# EAGLE design SWR5.1 (EAGLE 9.3.2)
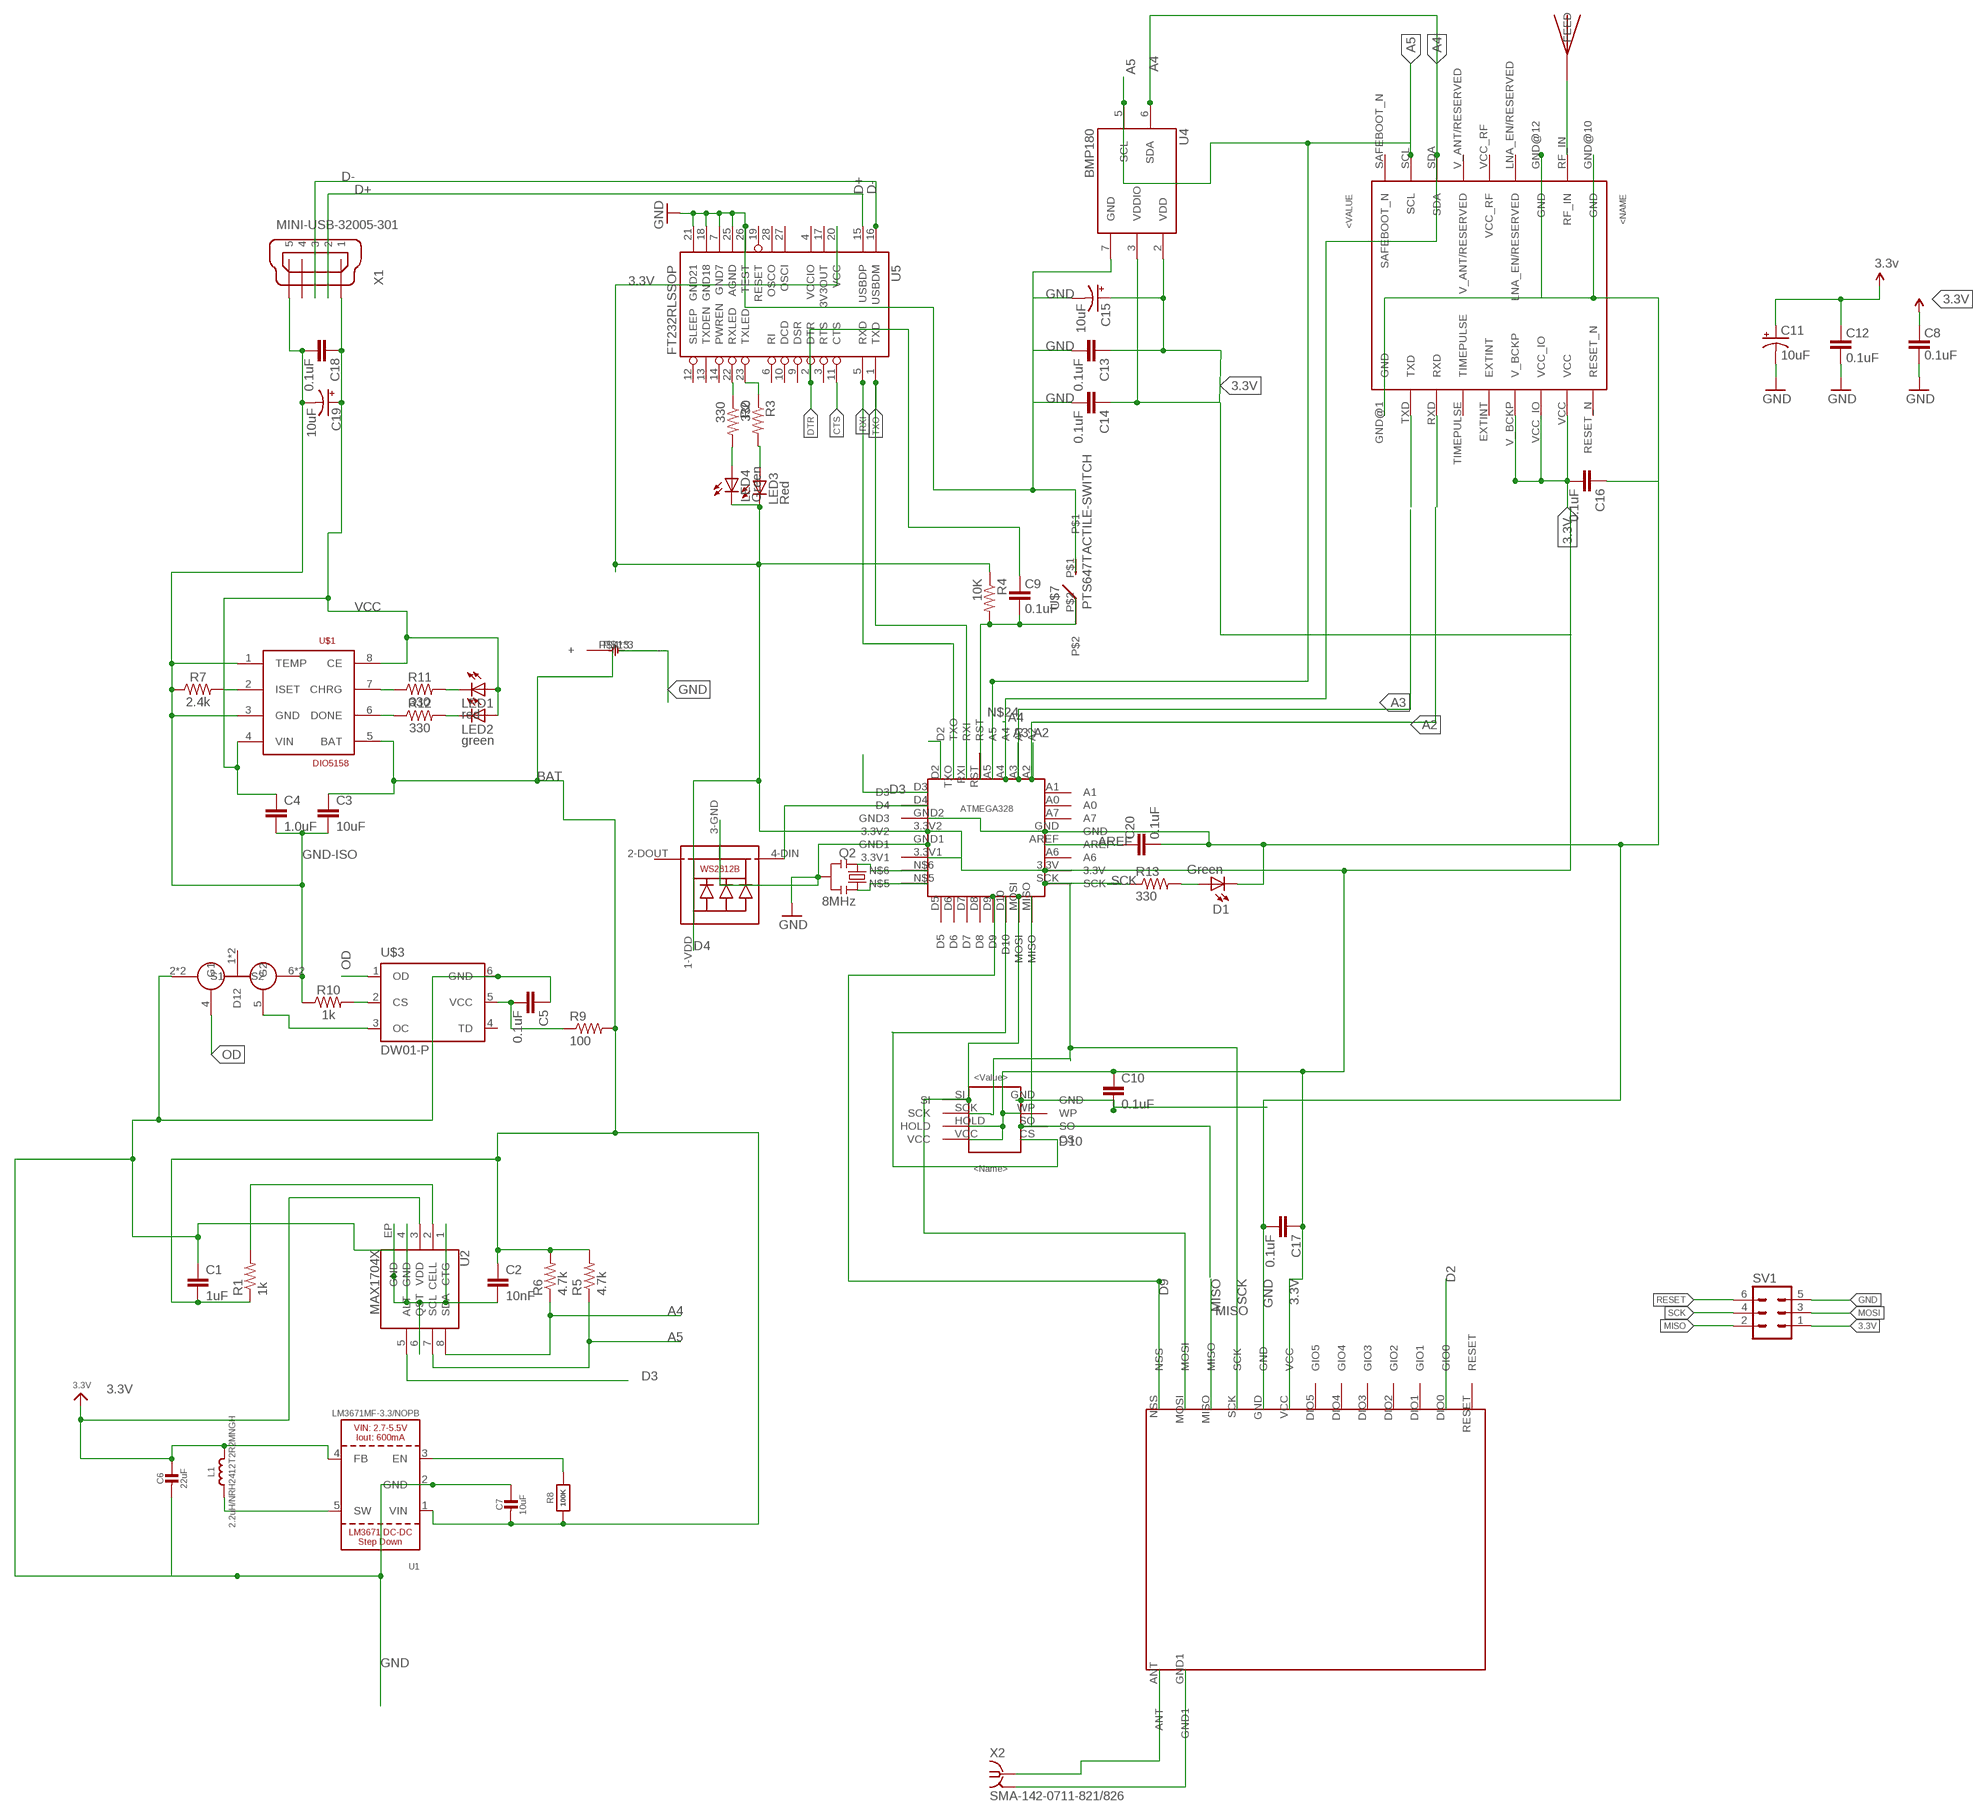
[diagram p0: schematic, sheet 1]

## Parts
C1  1uF  CAP0402-CAP  [0402-CAP]
C2  10nF  CAP0402-CAP  [0402-CAP]
C3  10uF  10UF-1206-6.3V-20%  [1206]
C4  1.0uF  1.0UF-0603-16V-10%  [0603]
C5  0.1uF  0.1UF-0603-25V-5%  [0603]
C6  22uF  CAP_CERAMIC0805-NOOUTLINE  [0805-NO]
C7  10uF  CAP_CERAMIC0805-NOOUTLINE  [0805-NO]
C8  0.1uF  CAP0603-CAP  [0603-CAP]
C9  0.1uF  CAP0603-CAP  [0603-CAP]
C10  0.1uF  CAP0603-CAP  [0603-CAP]
C11  10uF  CAP_POL3528  [EIA3528]
C12  0.1uF  CAP0603-CAP  [0603-CAP]
C13  0.1uF  CAP0603-CAP  [0603-CAP]
C14  0.1uF  CAP0603-CAP  [0603-CAP]
C15  10uF  10UF-16V-10%(TANT)  [EIA3216]
C16  0.1uF  CAP0603-CAP  [0603-CAP]
C17  0.1uF  CAP0603-CAP  [0603-CAP]
C18  0.1uF  CAP0603-CAP  [0603-CAP]
C19  10uF  CAP_POL1206  [EIA3216]
C20  0.1uF  CAP0603-CAP  [0603-CAP]
D1  Green  LED  [0603-LED-ALT1]
GND-ISO  18650BATT  [18650BATT]
L1  2.2uH/NRH2412T2R2MNGH  INDUCTORNRH2412T  [INDUCTOR_TAIYOYUDEN_NRH2412T]
LED1  red  LEDCHIP-LED0805  [CHIP-LED0805]
LED2  green  LEDCHIP-LED0805  [CHIP-LED0805]
LED3  Red  LED0603  [LED-0603]
LED4  Green  LED0603  [LED-0603]
LED5  WS2812B5050  [WS2812B]
LORATX  SX1272BETTER  [SX1272BETTER]
Q2  8MHz  RESONATOR1:1  [RESONATOR-SMD-1:1]
R1  1k  RESISTOR0402-RES  [0402-RES]
R2  330  RESISTOR0603-RES  [0603-RES]
R3  330  RESISTOR0603-RES  [0603-RES]
R4  10K  RESISTOR0603-RES  [0603-RES]
R5  4.7k  RESISTOR0402-RES  [0402-RES]
R6  4.7k  RESISTOR0402-RES  [0402-RES]
R7  2.4k  2.49KOHM-0603-1/10W-1%  [0603]
R8  100K  RESISTOR0805_NOOUTLINE  [0805-NO]
R9  100  RESISTOR0603-RES  [0603-RES]
R10  1k  1KOHM-0603-1/10W-1%  [0603]
R11  330  330OHM-0603-1/10W-1%  [0603]
R12  330  330OHM-0603-1/10W-1%  [0603]
R13  330  RESISTOR0603-RES  [0603-RES]
SV1  MA03-2  [MA03-2]
U1  LM3671MF-3.3/NOPB  VREG_LM3671  [SOT23-5]
U2  MAX1704X  [TDFN-8]
U4  BMP180  [BMP180]
U5  FT232RLSSOP  [SSOP28DB]
U$1  DIO5158  [SOIC-8]
U$2  AT25STORAGE  [AT25STORAGE]
U$3  DW01-P  [SOT23-6L]
U$4  FS8205A  [TSSOP8]
U$5  ATMEGA328  [ATMEGA328]
U$7  PTS647TACTILE-SWITCH  [PTS647TACTILE-SWITCH]
U$8  AVA_JTI_ANTENNA-1575AT43A40  [AVA_JTI_ANTENNA-1575AT43A40]
UBLX_MAX-M8Q  UBLXM8Q  [UBLOXM8Q]
X1  MINI-USB-32005-301  [32005-301]
X2  SMA-142-0711-821/826  [J502-ND-142-0711-821/826]

## Nets
3.3V: C6.1 C8.2 C10.1 C11.A(+) C12.2 C13.1 C14.1 C15.A(+) C16.2 C17.1 L1.2 LED3.C LED4.C LED5.1-VDD(VDD) LORATX.VCC R4.1 SV1.1 U1.4(FB) U2.3(VDD) U4.2(VDD) U4.3(VDDIO) U5.20(VCC) U$2.HOLD U$2.VCC U$2.WP U$5.3.3V U$5.3.3V1 U$5.3.3V2 UBLX_MAX-M8Q.V_BCKP UBLX_MAX-M8Q.VCC UBLX_MAX-M8Q.VCC_IO ; supply symbol labelled 3.3v, VCC
A2: U$5.A2 UBLX_MAX-M8Q.RXD
A3: U$5.A3 UBLX_MAX-M8Q.TXD
A4: R6.1 U2.8(SDA) U4.6(SDA) U$5.A4 UBLX_MAX-M8Q.SDA
A5: R5.1 U2.7(SCL) U4.5(SCL) U$5.A5 UBLX_MAX-M8Q.SCL
AREF: C20.2 U$5.AREF
BAT: C1.2 C2.1 C3.1 C7.2 GND-ISO.P$4(+) GND-ISO.P$5(+) GND-ISO.P$6(+) R1.1 R5.2 R6.2 R8.1 R9.2 U1.1(VIN) U$1.5(BAT)
CELL: R1.2 U2.2(CELL)
CHRG: R11.1 U$1.7(CHRG)
CS: R10.2 U$3.2(CS)
CTS: U5.11(CTS)
D2: LORATX.DIO0(GIO0) U$5.D2
D3: U2.5(ALT) U$5.D3
D4: LED5.4-DIN(DI) U$5.D4
D9: LORATX.NSS U$5.D9
D10: U$2.CS U$5.D10
D+: U5.15(USBDP) X1.2
D-: U5.16(USBDM) X1.3
DONE: R12.1 U$1.6(DONE)
DTR: C9.2 U5.2(DTR)
EN: R8.2 U1.3(EN)
GND: C1.1 C2.2 C5.1 C6.2 C7.1 C8.1 C10.2 C11.C(-) C12.1 C13.2 C14.2 C15.C(-) C16.1 C17.2 C20.1 D1.C GND-ISO.P$1(-) GND-ISO.P$2(-) GND-ISO.P$3(-) LED5.3-GND(GND) LORATX.GND LORATX.GND1 Q2.2 SV1.5 U1.2(GND) U2.1(CTG) U2.4(GND) U2.6(QST) U2.EP(GND) U4.7(GND) U5.7(GND7) U5.18(GND18) U5.21(GND21) U5.25(AGND) U5.26(TEST) U$2.GND U$3.6(GND) U$4.2(S1) U$4.3(S1) U$5.GND U$5.GND1 U$5.GND2(GND3) U$7.P$1 UBLX_MAX-M8Q.GND@1(GND) UBLX_MAX-M8Q.GND@10(GND) UBLX_MAX-M8Q.GND@12(GND) X2.G@1 X2.G@2 X2.G@3 X2.G@4
GND-ISO: C3.2 C4.2 C18.2 C19.C(-) R7.1 R10.1 U$1.1(TEMP) U$1.3(GND) U$4.6(S2) U$4.7(S2) X1.5
ISET: R7.2 U$1.2(ISET)
LED2: LED2.C R12.2
MISO: LORATX.MISO SV1.2 U$2.SO U$5.MISO
MOSI: LORATX.MOSI SV1.3 U$2.SI U$5.MOSI
N$1: C5.2 R9.1 U$3.5(VCC)
N$2: R3.1 U5.23(TXLED)
N$7: R2.1 U5.22(RXLED)
N$12: Q2.3 U$5.N$5
N$14: LED1.C R11.2
N$17: Q2.1 U$5.N$6
N$25: LED4.A R2.2
N$26: LORATX.ANT X2.1
N$29: LED3.A R3.2
N$31: D1.A R13.2
OC: U$3.3(OC) U$4.5(G2)
OD: U$3.1(OD) U$4.4(G1)
RESET: C9.1 R4.2 SV1.6 U$5.RST U$7.P$2
RF_IN: U$8.FEED UBLX_MAX-M8Q.RF_IN
RXI: U5.5(RXD) U$5.TXO
SCK: LORATX.SCK R13.1 SV1.4 U$2.SCK U$5.SCK
SW: L1.1 U1.5(SW)
TXO: U5.1(TXD) U$5.RXI
VCC: C4.1 C18.1 C19.A(+) LED1.A LED2.A U$1.4(VIN) U$1.8(CE) X1.1
Unconnected: LED5.2-DOUT(DO) LORATX.DIO1(GIO1) LORATX.DIO2(GIO2) LORATX.DIO3(GIO3) LORATX.DIO4(GIO4) LORATX.DIO5(GIO5) LORATX.RESET U5.3(RTS) U5.6(RI) U5.9(DSR) U5.10(DCD) U5.12(SLEEP) U5.13(TXDEN) U5.14(PWREN) U5.17(3V3OUT) U5.19(RESET) U5.27(OSCI) U5.28(OSCO) U$3.4(TD) U$4.1(D12) U$4.8(D12) U$5.A0 U$5.A1 U$5.A6 U$5.A7 U$5.D5 U$5.D6 U$5.D7 U$5.D8 UBLX_MAX-M8Q.EXTINT UBLX_MAX-M8Q.LNA_EN/RESERVED UBLX_MAX-M8Q.RESET_N UBLX_MAX-M8Q.SAFEBOOT_N UBLX_MAX-M8Q.TIMEPULSE UBLX_MAX-M8Q.V_ANT/RESERVED UBLX_MAX-M8Q.VCC_RF X1.4

## Power pins joined to a net without a drawn wire
VCCIO: U5.4(VCCIO)

## Library data of the parts
C1 C2 C8 C9 C12 C18 C20 = SparkFun:CAP: Capacitor Standard 0603 ceramic capacitor, and 0.1" leaded capacitor.
C3 = SparkFun-Capacitors:10UF: 10.0µF ceramic capacitors A capacitor is a passive two-terminal electrical component used to store electrical energy temporarily in an electric field.; PROD_ID: CAP-10057
C4 = SparkFun-Capacitors:1.0UF: 1µF ceramic capacitors A capacitor is a passive two-terminal electrical component used to store electrical energy temporarily in an electric field.; PROD_ID: CAP-00868
C5 = SparkFun-Capacitors:0.1UF: 0.1µF ceramic capacitors A capacitor is a passive two-terminal electrical component used to store electrical energy temporarily in an electric field.; PROD_ID: CAP-08604
C6 C7 = microbuilder:CAP_CERAMIC: Ceramic Capacitors For new designs, use the packages preceded by an '_' character since they are more reliable: The following footprints should be used on most boards: _0402 - Standard footprint for regular board layouts _0603 - Standard footprint for regular board layouts _0805 - Standard footprint for regular board layouts _1206 - Standard footprint for regular board layouts For extremely tight-pitch boards where space is at a premium, the following 'micro-pitch' footprints can be used (smaller pads, no silkscreen outline, etc.): _0402MP - Micro-pitch footprint for very dense/compact boards _0603MP - Micro-pitch footprint for very dense/compact boards _0805MP - Micro-pitch footprint for very dense/compact boards _1206MP - Micro-pitch footprint for very dense/compact boards
C10 C13 C14 C16 C17 = SparkFun-Capacitors:CAP: Capacitor Standard 0603 ceramic capacitor, and 0.1" leaded capacitor.
C11 C19 = SparkFun:CAP_POL: Capacitor Polarized These are standard SMD and PTH capacitors. Normally 10uF, 47uF, and 100uF in electrolytic and tantalum varieties. Always verify the external diameter of the through hole cap, it varies with capacity, voltage, and manufacturer. The EIA devices should be standard.
C15 = SparkFun-Capacitors:10UF-16V-10%(TANT): CAP-00811 1206/EIA-3216 Tantalum capacitor; PROD_ID: CAP-00811
D1 = Testing:LED: LEDs Standard schematic elements and footprints for 5mm, 3mm, 1206, and 0603 sized LEDs. 5mm - Spark Fun Electronics SKU : COM-00529 (and others)
GND-ISO = 18650BATT:18650BATT
L1 = microbuilder:INDUCTOR: Inductors 0603: 10nH Ceramic Inductor - microwire antenna/RF (Digikey: 712-1434-2-ND) 0805: 560nH Ceramic Inductor - RF (Digikey: 553-1047-1-ND) 270nH Ceramic Inductor - Q = 40@250MHz, +-5%, 1 Ohm DC Resistance (Digikey: 535-10506-2-ND) 1007 (2518 Metric) SMT: 10µH 10% 250mOhm 820mA 1007 Inductor (Digikey: 587-2189-1-ND) 22µH 10% 500mOhm 580mA 1007 Inductor (Digikey: 587-2190-1-ND) 47µH 10% 950mOhm 420mA 1007 Inductor (Digikey: 587-2191-1-ND) 47µH 5% 100mOhm 1A 1008 Inductor (Digikey: 732-1816-1-ND) 5.0x5.0mm (Taiyo Yuden NR5040 Series) 6.8µH 20% 2.3A 64mOhm Inductor (Digikey: 587-2374-2-ND) 5.0x5.0mm (TDK VLC5045 Series) 4.7µH 20% 3.3A 34mOhm Inductor (Digikey: 445-6526-1-ND) 6.8µH 20% 2.7A 46mOhm Inductor (Digikey: 445-6527-1-ND) 6.0x6.0mm (TDK VLC6045 Series) 4.7µH 20% 3.8A 27mOhm Inductor (Digikey: 445-6538-2-ND) 6.8µH 20% 3A 41mOhm Inductor (Digikey: 445-6540-1-ND) 6.2µH 30% 2.2A 45mOhm Inductor (Digikey: SRR5028-6R2YCT-ND) - Not TDK VLC6045 but footprint should match 6.0x6.0mm (TDK SLF6045 Series) 6.8uH 30% 2A 33mOhm Inductor (Digikey: 445-4572-1-ND, Mouser: 810-SLF645T6R8N2R0PF) 6.0x6.0mm (Sumida CDRH5D28 Series) 6.2uH 30% 1.8A 45mOhm Inductor (Digikey: 308-1542-1-ND) Taiyo Yuden NR3015T2R2M - 2.2uH 20% 1.5A (Digikey: 587-1648-2-ND, Mouser: 963-NR3015T2R2M) - Used with TI TPS62172 CoilCraft RFID Transponder Coil - MA5532-AE (For use with AS3935 Lightning Sensor) Taiyo Yuden NRH2412T2R2MNGH - 2.2uH 20% 1AA (Digikey: 587-3443-1-ND) - Used with TI LM3671 Vishay IHLP 1.0uH Molded Inductor - 24mOhm DCR, 5A, +/-20%, -55°C-125°C (Digikey: 541-1319-1-ND)
LED1 LED2 = adafruit:LED: LED OSRAM: - CHIPLED LG R971, LG N971, LY N971, LG Q971, LY Q971, LO R971, LY R971 LH N974, LH R974 LS Q976, LO Q976, LY Q976 LO Q996 - Hyper CHIPLED LW Q18S LB Q993, LB Q99A, LB R99A - SideLED LS A670, LO A670, LY A670, LG A670, LP A670 LB A673, LV A673, LT A673, LW A673 LH A674 LY A675 LS A676, LA A676, LO A676, LY A676, LW A676 LS A679, LY A679, LG A679 - Hyper Micro SIDELED® LS Y876, LA Y876, LO Y876, LY Y876 LT Y87S - SmartLED LW L88C, LW L88S LB L89C, LB L89S, LG L890 LS L89K, LO L89K, LY L89K LS L896, LA L896, LO L896, LY L896 - TOPLED LS T670, LO T670, LY T670, LG T670, LP T670 LSG T670, LSP T670, LSY T670, LOP T670, LYG T670 LG T671, LOG T671, LSG T671 LB T673, LV T673, LT T673, LW T673 LH T674 LS T676, LA T676, LO T676, LY T676, LB T676, LH T676, LSB T676, LW T676 LB T67C, LV T67C, LT T67C, LS T67K, LO T67K, LY T67K, LW E67C LS E67B, LA E67B, LO E67B, LY E67B, LB E67C, LV E67C, LT E67C LW T67C LS T679, LY T679, LG T679 LS T770, LO T770, LY T770, LG T770, LP T770 LB T773, LV T773, LT T773, LW T773 LH T774 LS E675, LA E675, LY E675, LS T675 LS T776, LA T776, LO T776, LY T776, LB T776 LHGB T686 LT T68C, LB T68C - Hyper Mini TOPLED® LB M676 - Mini TOPLED Santana® LG M470 LS M47K, LO M47K, LY M47K Source: http://www.osram.convergy.de/
LED3 LED4 = SparkFun:LED: LEDs Standard schematic elements and footprints for 5mm, 3mm, 1206, and 0603 sized LEDs. 5mm - Spark Fun Electronics SKU : COM-00529 (and others)
LED5 = microbuilder:WS2812B5050
LORATX = SX1272:SX1272BETTER
Q2 = Testing:RESONATOR: Resonator Small SMD resonator. This is the itty bitty 10/20MHz resonators with built in caps. CSTCE10M0G55 and CSTCE20M0V53. Footprint for SMD has been used in SFE production for years, and does work okay. 1:1 is an attempt to get larger fillets on the sides so it will be easier to inspect these solders in our AOI machine. The pads have been minimized to match the actual metal under the resonator. To see this relation, it includes an image import of the bottom side of the component. Imported to scale on layer 200.
R1-R6 R9 R13 = SparkFun:RESISTOR: Resistor Basic schematic elements and footprints for 0603, 1206, and PTH resistors.
R7 = SparkFun-Resistors:2.49KOHM: 2.49kΩ resistor A resistor is a passive two-terminal electrical component that implements electrical resistance as a circuit element. Resistors act to reduce current flow, and, at the same time, act to lower voltage levels within circuits. - Wikipedia; PROD_ID: RES-09568; VALUE: 2.49k
R8 = microbuilder:RESISTOR: Resistors For new designs, use the packages preceded by an '_' character since they are more reliable: The following footprints should be used on most boards: _0402 - Standard footprint for regular board layouts _0603 - Standard footprint for regular board layouts _0805 - Standard footprint for regular board layouts _1206 - Standard footprint for regular board layouts For extremely tight-pitch boards where space is at a premium, the following 'micro-pitch' footprints can be used (smaller pads, no silkscreen outline, etc.): _0402MP - Micro-pitch footprint for very dense/compact boards _0603MP - Micro-pitch footprint for very dense/compact boards _0805MP - Micro-pitch footprint for very dense/compact boards _1206MP - Micro-pitch footprint for very dense/compact boards
R10 = SparkFun-Resistors:1KOHM: 1kΩ resistor A resistor is a passive two-terminal electrical component that implements electrical resistance as a circuit element. Resistors act to reduce current flow, and, at the same time, act to lower voltage levels within circuits. - Wikipedia; PROD_ID: RES-07856
R11 R12 = SparkFun-Resistors:330OHM: 330Ω resistor A resistor is a passive two-terminal electrical component that implements electrical resistance as a circuit element. Resistors act to reduce current flow, and, at the same time, act to lower voltage levels within circuits. - Wikipedia; PROD_ID: RES-00818
SV1 = con-lstb:MA03-2: PIN HEADER; OC_FARNELL: unknown; OC_NEWARK: unknown
U1 = microbuilder:VREG_LM3671: LM3671 - 600mA DC-DC Step-Down Converter VIN: 2.7-5.5V Load Current: 600mA Switching Frequency: 2MHz Iq: 16uA
U2 = SparkFun:MAX1704X: MAX17043/MAX17044: Battery Fuel Guage (43 is 1cell, 44 is 2cell)
U4 = SparkFun-Sensors:BMP180: BOSCH BMP180 DIGITAL BAROMETRIC PRESSURE SENSOR Web page: http://www.bosch-sensortec.com/en/homepage/products_3/environmental_sensors_1/bmp180_1/bmp180 Datasheet: http://ae-bst.resource.bosch.com/media/products/dokumente/bmp180/BST-BMP180-DS000-09.pdf The BMP180 is the function compatible successor of the BMP085, a new generation of high precision digital pressure sensors for consumer applications. The ultra-low power, low voltage electronics of the BMP180 is optimized for use in mobile phones, PDAs, GPS navigation devices and outdoor equipment. With a low altitude noise of merely 0.25m at fast conversion time, the BMP180 offers superior performance. The I2C interface allows for easy system integration with a microcontroller. The BMP180 is based on piezo-resistive technology for EMC robustness, high accuracy and linearity as well as long term stability. Key features: - Temperature measurement included - I2C interface - Fully calibrated - Pb-free, halogen-free and RoHS compliant, - MSL 1 Basic specs: Pressure range: 300 to 1100hPa (+9000m to -500m relating to sea level) Supply voltage: 1.8 to 3.6V (VDD), 1.62V to 3.6V (VDDIO) Package: LGA package with metal lid Small footprint: 3.6mm x 3.8mm Super-flat: 0.93mm height Low power: 5μA at 1 sample / sec. in standard mode Low noise: 0.06hPa (0.5m) in ultra low power mode, 0.02hPa (0.17m) advanced resolution mode Typical applications: - Enhancement of GPS navigation (dead-reckoning, slope detection, etc.) - In- and out-door navigation - Leisure and sports - Weather forecast - Vertical velocity indication (rise/sink speed)
U5 = SparkFun:FT232RL: USB UART FT232RL 4th Generation USB UART (USB <-> Serial) Controller. Spark Fun Electronics SKU : COM-00650
U$1 = ERADIONICA:DIO5158
U$2 = Flash Memory 4Mb:AT25STORAGE
U$3 = lipo:DW01-P: One Cell Lithium-ion/Polymer Battery Protection IC The DW01-P battery protection IC is designed to protect lithium-ion/polymer battery from damage or degrading the lifetime due to overcharge, overdischarge, and/or overcurrent for one-cell lithium-ion/polymer battery powered systems, such as cellular phones. The ultra-small package and less required external components make it ideal to integrate the DW01-P into the limited space of battery pack. The accurate ±50mV overcharging detection voltage ensures safe and full utilization charging. The very low standby current drains little current from the cell while in storage.
U$4 = SparkFun:FS8205A
U$5 = ATMEGA328P:ATMEGA328
U$7 = PTS647-Switch:PTS647TACTILE-SWITCH
U$8 = picoAVA-R9:AVA_JTI_ANTENNA-1575AT43A40; OC_NEWARK: unknown
UBLX_MAX-M8Q = UBLOX_M8Q_GPS:UBLXM8Q
X1 = con-cypressindustries:MINI-USB-: MINI USB-B Conector Source: www.cypressindustries.com; OC_FARNELL: unknown; OC_NEWARK: unknown
X2 = con-coax:SMA-: SMA 50 Ohm End Launch Jack Receptacle - Round Contact Johnson Components Source: www.johnsoncomponents.com .. J502-ND.pdf; MF: JOHNSON COMPONENTS; MPN: 142-0711-821; OC_FARNELL: 1019328; OC_NEWARK: 16F3627

## Board
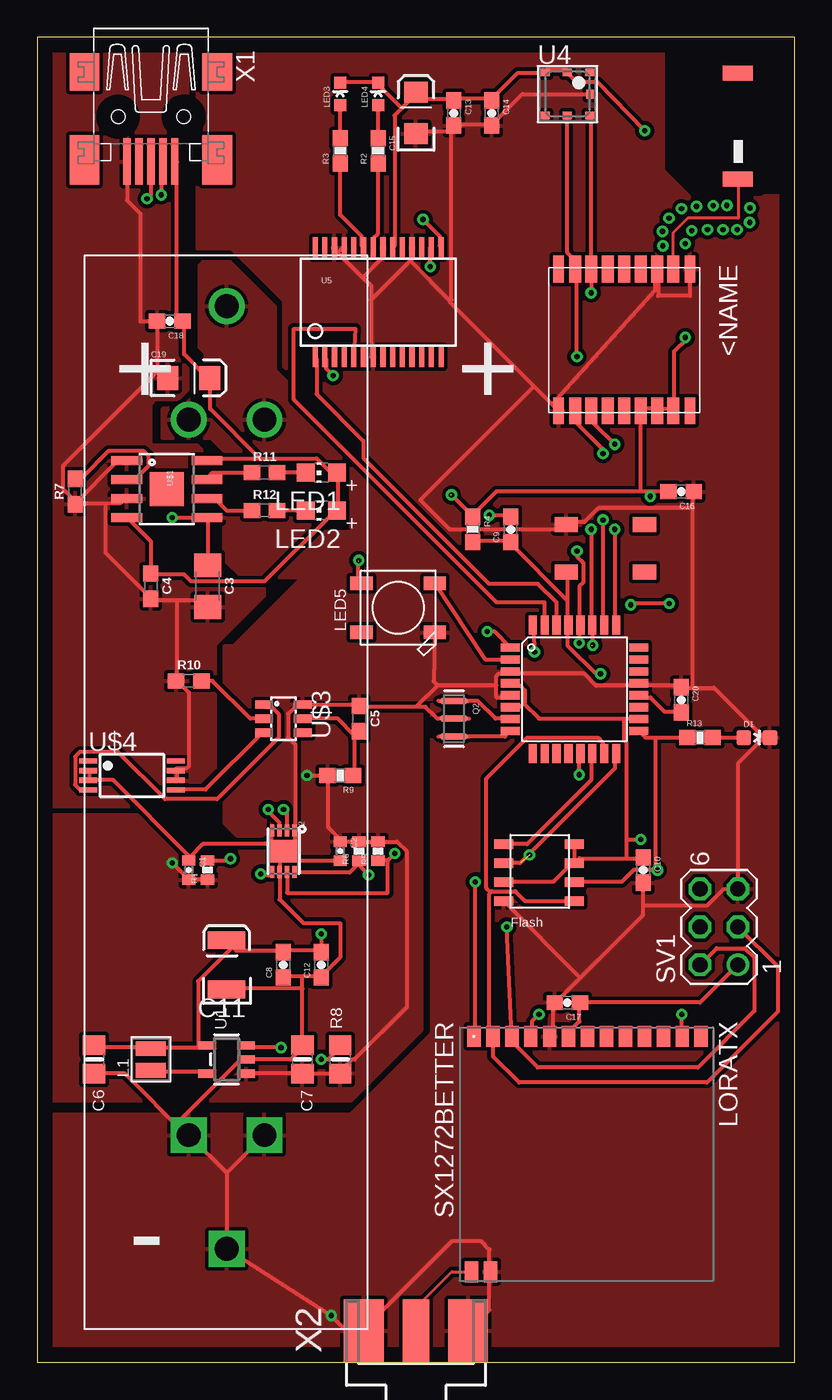
[diagram p1: board, top side]
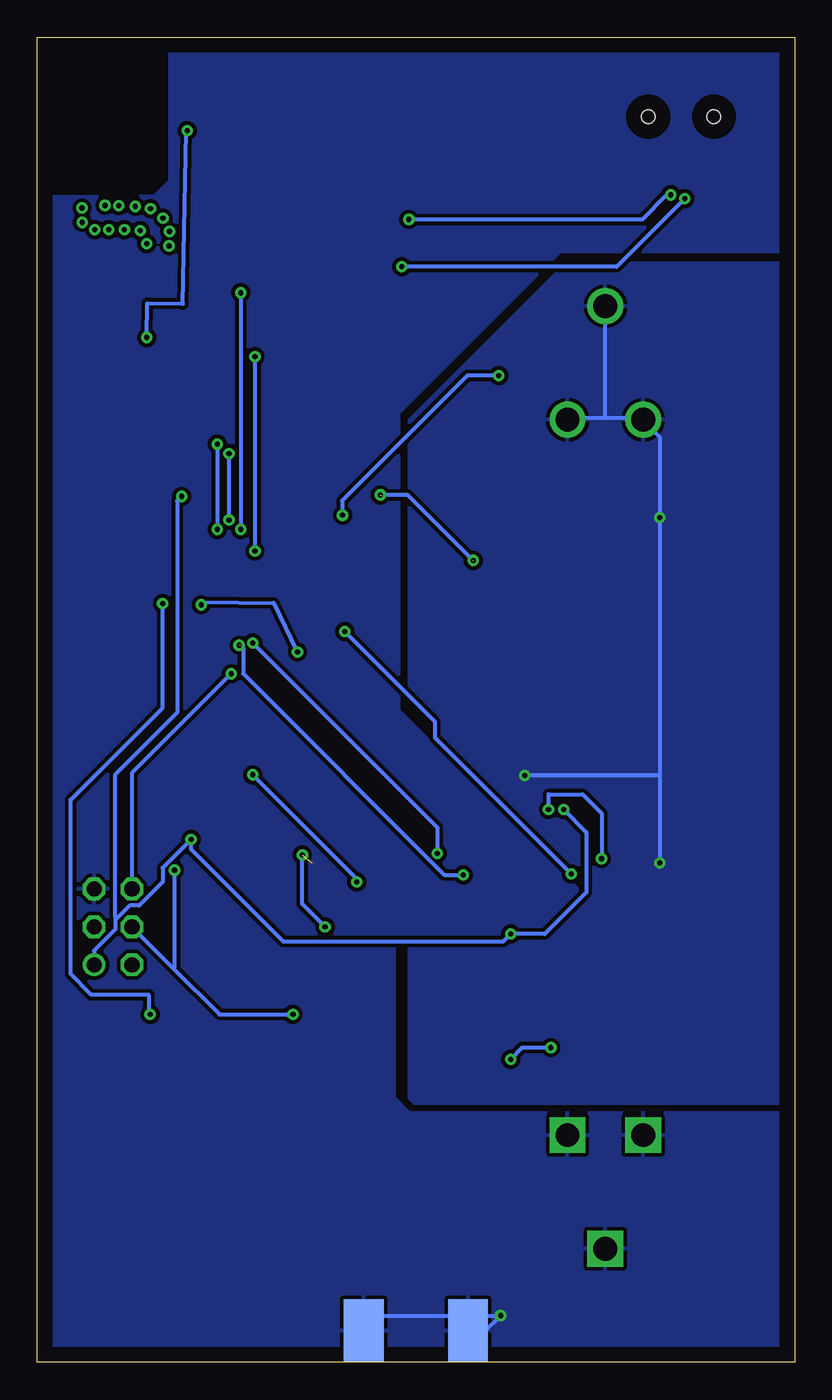
[diagram p2: board, bottom side, seen from below]

Size 50.8 x 88.9 mm. Coordinates in mm from the lower left corner, seen from the top.
Outline: 0,0 50.8,0 50.8,88.9 0,88.9 0,0
Copper layers (1*16): Top 0.035mm / dielectric 1.5mm / Bottom 0.035mm
Design rules "default *": minimum track width 10mil, minimum drill 0.35mm, track to track 10mil, track to pad 6mil, pad to pad 6mil, via to via 6mil, smd to smd 6mil, copper to edge 40mil, drill to drill 6mil, minimum pad ring 10mil, minimum via ring 8mil, stop-mask expansion 4mil, vias tented up to drill 0mil, thermal gap 10mil
tRestrict: area 42.6,78.8 to 45.8,88.7; area 45.8,87 to 50.8,88.9; area 48.2,80.1 to 50.8,87.1; area 44.4,78.8 to 48.2,85.8
bRestrict: area 42.6,78.8 to 50.8,88.9

### Footprints (pad centres in the part's own frame; a part is rotated, then mirrored left to right if it is on the bottom)
0402-CAP = smd 0.7 x 0.9: 1 -0.65,0; 2 0.65,0
1206 = smd 1.6 x 1.8: 1 -1.4,0; 2 1.4,0
0603 = smd 1.1 x 1: 1 -0.85,0; 2 0.85,0
0805-NO = smd 1.3 x 1.5: 1 -0.95,0; 2 0.95,0
0603-CAP = smd 1.1 x 1: 1 -0.85,0; 2 0.85,0
EIA3528 = smd 1.2 x 2.5: A 1.65,0; C -1.65,0
EIA3216 = smd 1.4 x 1.6: A 1.4,0; C -1.4,0
0603-LED-ALT1 = smd 1 x 1: A 0,-0.877; C 0,0.877
18650BATT = drill 1.6 square: P$1 0,0; P$2 5.08,0; P$3 2.54,-7.62 | drill 1.6: P$4 0,48; P$5 5.08,48; P$6 2.54,55.62
INDUCTOR_TAIYOYUDEN_NRH2412T = smd 1 x 2: 1 -0.725,0; 2 0.725,0
CHIP-LED0805 = smd 1.2 x 1.2: A 0,-1.05; C 0,1.05
LED-0603 = smd 0.8 x 0.8: A 0,-0.75; C 0,0.75
WS2812B = smd 1.5 x 0.9: 1-VDD 2.45,-1.65; 2-DOUT 2.45,1.65; 3-GND -2.45,1.65; 4-DIN -2.45,-1.65
SX1272BETTER = smd 1.4 x 0.9: ANT 7.9,-7.7; DIO0 -7.9,6.43; DIO1 -7.9,5.16; DIO2 -7.9,3.89; DIO3 -7.9,2.62; DIO4 -7.9,1.35; DIO5 -7.9,0.08; GND -7.9,-2.46; GND1 7.9,-6.43; MISO -7.9,-5; MOSI -7.9,-6.27; NSS -7.9,-7.54; RESET -7.9,7.7; SCK -7.9,-3.73; VCC -7.9,-1.19
RESONATOR-SMD-1:1 = smd 0.45 x 1.905: 1 -1.2,0; 2 0,0; 3 1.2,0
0402-RES = smd 0.7 x 0.9: 1 -0.65,0; 2 0.65,0
0603-RES = smd 1.1 x 1: 1 -0.85,0; 2 0.85,0
MA03-2 = drill 1.016: 1 -2.54,-1.27 | drill 1.016 octagon: 2 -2.54,1.27; 3 0,-1.27; 4 0,1.27; 5 2.54,-1.27; 6 2.54,1.27
SOT23-5 = smd 0.55 x 1.2: 1 -0.95,-1.3; 2 0,-1.3; 3 0.95,-1.3; 4 0.95,1.3; 5 -0.95,1.3
TDFN-8 = smd 0.8 x 0.3: 1 -1.4,0.75; 2 -1.4,0.25; 3 -1.4,-0.25; 4 -1.4,-0.75; 5 1.4,-0.75; 6 1.4,-0.25; 7 1.4,0.25; 8 1.4,0.75 | smd 1.5 x 1.88: EP 0,0
BMP180 = smd 0.6 x 0.5: 1 1.5,1.45; 2 0,1.45; 3 -1.5,1.45; 4 -1.5,-1.45; 5 0,-1.45; 6 1.5,-1.45 | smd 0.5 x 0.6: 7 1.5,0
SSOP28DB = smd 0.348 x 1.397: 1 -4.225,-3.656; 2 -3.575,-3.656; 3 -2.925,-3.656; 4 -2.275,-3.656; 5 -1.625,-3.656; 6 -0.975,-3.656; 7 -0.325,-3.656; 8 0.325,-3.656; 9 0.975,-3.656; 10 1.625,-3.656; 11 2.275,-3.656; 12 2.925,-3.656; 13 3.575,-3.656; 14 4.225,-3.656; 15 4.225,3.656; 16 3.575,3.656; 17 2.925,3.656; 18 2.275,3.656; 19 1.625,3.656; 20 0.975,3.656; 21 0.325,3.656; 22 -0.325,3.656; 23 -0.975,3.656; 24 -1.625,3.656; 25 -2.275,3.656; 26 -2.925,3.656; 27 -3.575,3.656; 28 -4.225,3.656
SOIC-8 = smd 0.61 x 2.057: 1 -2.07,-2.892; 2 -0.8,-2.892; 3 0.47,-2.892; 4 1.74,-2.892; 5 1.74,2.492; 6 0.47,2.492; 7 -0.8,2.492; 8 -2.07,2.492 | smd 2.286 x 2.286: EPAD -0.165,-0.2
AT25STORAGE = smd 1.27 x 0.635: CS -0.46,4.27; GND -0.46,0.46; HOLD 4.27,3; SCK 4.27,1.74; SI 4.27,0.46; SO -0.46,3; VCC 4.27,4.27; WP -0.46,1.73
SOT23-6L = smd 0.55 x 1.2: 1 -0.95,-1.3; 2 0,-1.3; 3 0.95,-1.3; 4 0.95,1.3; 5 0,1.3; 6 -0.95,1.3
TSSOP8 = smd 1.2 x 0.35: 1 -2.925,0.975; 2 -2.925,0.325; 3 -2.925,-0.325; 4 -2.925,-0.975; 5 2.925,-0.975; 6 2.925,-0.325; 7 2.925,0.325; 8 2.925,0.975
ATMEGA328 = smd 1.27 x 0.55: 3.3V 3.5,-1.3; 3.3V1 -5.1,-0.5; 3.3V2 -5.1,1.1; A0 3.5,2.7; A1 3.5,3.5; A6 3.5,-0.5; A7 3.5,1.9; AREF 3.5,0.3; D3 -5.1,3.5; D4 -5.1,2.7; GND 3.5,1.1; GND1 -5.1,0.3; GND2 -5.1,1.9; N$5 -5.1,-2.1; N$6 -5.1,-1.3; SCK 3.5,-2.1 | smd 0.55 x 1.27: A2 2,5; A3 1.2,5; A4 0.4,5; A5 -0.4,5; D2 -3.6,5; D5 -3.6,-3.6; D6 -2.8,-3.6; D7 -2,-3.6; D8 -1.2,-3.6; D9 -0.4,-3.6; D10 0.4,-3.6; MISO 2,-3.6; MOSI 1.2,-3.6; RST -1.2,5; RXI -2,5; TXO -2.8,5
PTS647TACTILE-SWITCH = smd 1.55 x 1: P$1 -2.625,1.6; P$2 -2.625,-1.6; P$3 2.625,-1.6; P$4 2.625,1.6
AVA_JTI_ANTENNA-1575AT43A40 = smd 1 x 2: FEED -3.175,0; NC 3.925,0
UBLOXM8Q = smd 1.8 x 0.8: EXTINT 4.75,0; GND@12 -4.75,2.2; LNA_EN/RESERVED -4.75,1.1; RF_IN -4.75,3.3; RXD 4.75,-2.2; SCL -4.75,-3.3; SDA -4.75,-2.2; TIMEPULSE 4.75,-1.1; TXD 4.75,-3.3; V_ANT/RESERVED -4.75,-1.1; V_BCKP 4.75,1.1; VCC 4.75,3.3; VCC_IO 4.75,2.2; VCC_RF -4.75,0 | smd 1.8 x 0.7: GND@1 4.75,-4.4; GND@10 -4.75,4.4; RESET_N 4.75,4.4; SAFEBOOT_N -4.75,-4.4
32005-301 = smd 3.1 x 0.5: 1 3,1.6; 2 3,0.8; 3 3,0; 4 3,-0.8; 5 3,-1.6 | smd 2.5 x 2: M1 -3,-4.45; M2 -3,4.45 | smd 3.3 x 2: M3 2.9,4.45; M4 2.9,-4.45 | hole 0.9: 0,2.2; 0,-2.2
J502-ND-142-0711-821/826 = smd 4.191 x 1.778: 1 2.115,0 | smd 4.191 x 2.667: G@1 2.115,3.495; G@2 2.115,-3.495 | smd 4.191 x 2.667 bottom: G@3 2.115,3.495; G@4 2.115,-3.495

### Placement (x,y rotation side)
C1  10.16,33.02 270 top
C2  20.32,34.29 270 top
C3  11.43,52.07 270 top
C4  7.62,52.07 270 top
C5  21.59,43.18 270 top
C6  3.81,20.32 270 top
C7  17.78,20.32 270 top
C8  16.51,26.67 90 top
C9  31.75,55.88 90 top
C10  40.64,33.02 270 top
C11  12.7,26.67 90 top
C12  19.05,26.67 90 top
C13  27.94,83.82 270 top
C14  30.48,83.82 270 top
C15  25.4,83.82 90 top
C16  43.18,58.42 180 top
C17  35.56,24.13 180 top
C18  8.89,69.85 180 top
C19  10.16,66.04 0 top
C20  43.18,44.45 270 top
D1  48.26,41.91 270 top
GND-ISO  10.16,15.24 0 top
L1  7.62,20.32 90 top
LED1  19.05,59.69 90 top
LED2  19.05,57.15 90 top
LED3  20.32,85.09 0 top
LED4  22.86,85.09 0 top
LED5  24.21,50.62 180 top
LORATX  36.83,13.97 270 top
Q2  27.94,43.18 270 top
R1  11.43,33.02 90 top
R2  22.86,81.28 90 top
R3  20.32,81.28 90 top
R4  29.21,55.88 270 top
R5  22.86,34.29 90 top
R6  21.59,34.29 90 top
R7  2.54,58.42 90 top
R8  20.32,20.32 90 top
R9  20.32,39.37 180 top
R10  10.16,45.72 0 top
R11  15.24,59.69 0 top
R12  15.24,57.15 0 top
R13  44.45,41.91 0 top
SV1  45.72,29.21 90 top
U1  12.7,20.32 90 top
U2  16.51,34.29 270 top
U4  35.56,85.09 0 top
U5  22.86,71.12 0 top
U$1  8.89,58.42 270 top
U$2  31.75,30.48 0 top
U$3  16.51,43.18 270 top
U$4  6.35,39.37 0 top
U$5  36.83,44.45 0 top
U$7  38.1,54.61 0 top
U$8  46.99,82.55 90 top
UBLX_MAX-M8Q  39.37,68.58 270 top
X1  7.62,83.57 270 top
X2  25.4,0 90 top

### Tracks (layer width: path | path; a pad name or v marks a point on that pad's centre or on a via)
3.3V  (via drill 0.35)  (2 unrouted)
  Top 0.254: C16.2 41.12,58.42 | 41.12,58.42 40.48,58.42 | 40.48,58.42 30.8,58.42 29.21,56.83 R4.1 29.21,56.77 v27.79,58.19 | 40.48,58.42 40.48,63.82 UBLX_MAX-M8Q.V_BCKP 40.48,63.98 41.43,63.98 UBLX_MAX-M8Q.VCC_IO 41.59,63.98 42.55,63.98 UBLX_MAX-M8Q.VCC 42.7,63.98 42.7,67.81 43.55,68.66 v43.46,68.76 | 30.48,84.77 27.94,84.77 | 30.48,84.77 32.23,86.52 33.97,86.52 U4.3 34.13,86.68 35.56,86.68 U4.2 35.56,86.52 36.2,85.88 37.59,85.88 v40.74,82.63 | 30.48,84.77 C14.1 | LED3.C 20.32,85.88 22.86,85.88 LED4.C 22.86,85.72 24.45,84.14 | 24.45,84.14 25.4,85.09 C15.A 25.24,84.77 27.94,84.77 | 24.45,84.14 23.97,83.66 23.97,74.93 U5.20 | 27.94,84.77 C13.1 | 7.62,21.11 10.79,21.11 | 10.79,21.11 11.27,21.11 U1.4 | 7.62,21.11 3.81,21.11 C6.1 | 7.62,21.11 L1.2 | 19.05,27.62 16.51,27.62 | 16.51,27.62 13.34,27.62 12.7,28.26 C11.A 13.02,27.78 10.79,25.56 10.79,21.11 | 16.51,27.62 C8.2 | LORATX.VCC 35.72,21.91 35.72,22.23 36.35,22.86 36.35,24.13 C17.1 44.45,24.13 SV1.1 | 32.62,44.21 32.7,44.29 32.7,45.09 32.38,45.4 31.75,45.4 U$5.3.3V2 | 32.62,44.21 32.38,43.97 31.75,43.97 U$5.3.3V1 | 39.37,43.18 33.66,43.18 32.62,44.21 | 39.37,43.18 40.32,43.18 U$5.3.3V | 39.53,33.81 36.35,33.81 U$2.HOLD | 39.53,33.81 40.64,33.81 C10.1 | U$2.WP 31.43,32.23 34.61,32.23 35.88,33.5 U$2.HOLD | U$2.VCC 36.04,34.61 36.04,33.66 U$2.HOLD | 39.37,43.18 39.37,41.75 39.53,41.59 39.53,35.08 | 39.53,33.81 39.53,35.08 | 39.53,35.08 v40.48,35.08 | v19.05,28.73 19.05,27.62 | 19.05,27.62 C12.2 | v41.12,58.1 41.12,58.42 | U2.3 16.26,36.2 15.49,36.96 v15.49,37.08 | LED5.1-VDD 21.54,52.49 21.54,53.75
  Bottom 0.254: SV1.1 46.99,27.62 45.56,29.05 45.56,29.69 45.48,29.77 | 45.48,29.77 44.61,30.64 43.97,30.64 42.39,32.23 42.39,33.18 v40.48,35.08 40.48,34.42 34.29,28.23 19.56,28.23 v19.05,28.73 16.76,28.73 13.97,31.53 13.97,35.56 v15.49,37.08 | v41.12,58.1 41.42,57.8 41.42,43.58 45.56,39.44 45.56,29.84 45.48,29.77 | v43.46,68.76 43.41,71.05 41.04,71.02 41.03,71 40.8,82.56 v40.74,82.63 | v21.57,53.8 25.96,58.19 27.71,58.19
A2  (via drill 0.35)
  Top 0.254: v38.73,55.88 38.73,49.53 U$5.A2 | v38.73,61.59 37.31,63.02 37.31,63.82 UBLX_MAX-M8Q.RXD
  Bottom 0.254: v38.73,61.59 v38.73,55.88
A3  (via drill 0.35)
  Top 0.254: v37.94,56.52 37.94,49.53 U$5.A3 | v37.94,60.96 37.94,61.28 36.2,63.02 36.2,63.82 UBLX_MAX-M8Q.TXD
  Bottom 0.254: v37.94,60.96 v37.94,56.52
A4  (via drill 0.35)  (1 unrouted)
  Top 0.254: U2.8 17.3,32.86 20.95,32.86 21.59,33.5 R6.1 21.59,33.34 v22.23,32.7 | U4.6 37.15,83.5 37.15,73.34 UBLX_MAX-M8Q.SDA 37.15,73.18 v37.15,71.75 | v37.15,55.88 37.15,49.53 U$5.A4 v37.26,48.11
  Bottom 0.254: v37.15,71.75 v37.15,55.88 | v22.23,32.7 23.5,32.7 36.99,46.2 36.99,47.94 37.15,48.1
A5  (via drill 0.35)
  Top 0.254: U4.5 35.56,74.45 36.04,73.98 36.04,73.34 UBLX_MAX-M8Q.SCL 36.2,73.18 v36.2,67.47 | 23.5,33.66 22.86,33.66 R5.1 | v23.97,34.13 23.5,33.66 | 36.35,49.37 v36.35,48.26 | 36.35,49.37 U$5.A5 | U2.7 16.76,31.5 23.5,31.5 23.5,33.66 | v36.2,54.43 36.2,54.06 36.61,53.65 36.61,52.32 36.35,52.07 36.35,49.37
  Bottom 0.254: v23.97,34.13 23.97,35.88 v36.35,48.26 | v36.2,54.43 v36.2,67.47
AREF
  Top 0.254: C20.2 43.18,43.66 42.07,43.66 41.12,44.61 40.48,44.61 U$5.AREF
BAT  (via drill 0.35)
  Top 0.254: C7.2 14.13,19.37 U1.1 | C7.2 R8.1 20.32,19.53 21.11,20.32 21.27,20.32 24.77,23.81 24.77,34.29 24.13,34.92 22.86,34.92 | C7.2 | 21.59,34.92 20.32,34.92 C2.1 20.32,35.08 19.53,35.88 19.53,39.37 R9.2 v18.1,39.37 | 21.59,34.92 22.86,34.92 | 21.59,34.92 R6.2 | 22.86,34.92 R5.2 | C3.1 11.43,56.67 U$1.5 11.27,56.67 v9.05,56.67 | 10.16,32.38 11.43,32.38 R1.1 | v9.05,33.5 10.16,32.38 | 10.16,32.38 C1.2
  Bottom 0.254: 9.05,39.37 v9.05,56.67 9.05,62.07 10.16,63.18 GND-ISO.P$4 10.16,63.34 12.7,63.34 | 9.05,39.37 v9.05,33.5 | 12.7,63.34 15.24,63.34 GND-ISO.P$5 | 12.7,63.34 GND-ISO.P$6 | 9.05,39.37 v18.1,39.37
  pour Top: 0.28,17.58 21.06,17.58 25.78,22.3 25.78,56.72 15.95,66.55 15.95,70.79 12.93,73.81 11.13,73.81 10.87,73.56 10.87,68.1 11.25,67.72 11.25,65.23 10.21,64.54 9.65,63.98 8.46,63.98 8.38,63.91 8.38,62.08 8.36,62.05 11.63,62.05 12.52,61.16 12.52,53.9 13.82,52.6 16.33,52.6 16.33,51.46 12.57,47.7 12.57,38.89 10.36,36.68 0.18,36.68 0.18,17.68
  pour Bottom: 0.48,73.71 15.32,73.71 17.37,71.65 25.86,63.17 25.86,17.75 25.5,17.4 0.25,17.4 0.48,17.63
CELL  (via drill 0.35)
  Top 0.254: U2.2 16.76,36.83 v16.51,37.08 | R1.2 12.84,33.67 v12.95,33.78
  Bottom 0.254: v16.51,37.08 16.51,38.1 14.22,38.1 12.95,36.83 v12.95,33.78
CHRG
  Top 0.254: R11.1 11.75,59.69 11.43,59.37 U$1.7
CS
  Top 0.254: R10.2 11.75,45.72 14.29,43.18 U$3.2
D2  (via drill 0.35)
  Top 0.254: LORATX.DIO0 v43.23,23.34 | U$5.D2 v33.35,47.65 | v42.39,50.9 39.88,50.9 v39.8,50.83
  Bottom 0.254: v43.23,23.34 43.33,23.44 43.33,24.66 47.17,24.66 48.56,26.06 48.56,37.74 42.39,43.91 v42.39,50.9 | v39.8,50.83 39.62,51 34.95,50.95 v33.35,47.65
D3  (via drill 0.35)
  Top 0.254: U$5.D3 30.67,49.01 v30.18,49.02 | U2.5 15.51,32.64 v14.99,32.77
  Bottom 0.254: v14.99,32.77 24.13,41.91 24.13,42.98 v30.18,49.02
D4
  Top 0.254: LED5.4-DIN 30.06,47.15 U$5.D4
D9  (via drill 0.35)
  Top 0.254: v36.35,39.41 36.35,40.8 U$5.D9 | v29.37,32.23 29.37,21.91 LORATX.NSS
  Bottom 0.254: v36.35,39.41 29.37,32.43 v29.37,32.23
D10
  Top 0.254: U$2.CS 31.43,34.77 32.86,34.77 37.15,39.05 37.15,40.8 U$5.D10
D+  (via drill 0.35)
  Top 0.254: v25.88,76.68 26.99,75.56 26.99,74.93 U5.15 | X1.2 8.32,80.47 v8.32,78.33
  Bottom 0.254: v25.88,76.68 10.22,76.68 8.57,78.33 v8.32,78.33
D-  (via drill 0.35)
  Top 0.254: v26.35,73.5 26.35,74.77 U5.16 | X1.3 7.62,78.33 v7.37,78.07
  Bottom 0.254: v26.35,73.5 11.94,73.5 v7.37,78.07
DONE
  Top 0.254: R12.1 12.7,57.15 11.91,57.94 11.43,57.94 U$1.6
DTR  (via drill 0.35)
  Top 0.254: v30.32,56.83 31.75,56.83 C9.2 | v19.84,66.2 19.37,66.67 19.37,67.31 U5.2
  Bottom 0.254: v30.32,56.83 30.35,56.86 30.35,57.8 21.95,66.2 v19.84,66.2
EN  (via drill 0.35)
  Top 0.254: v16.35,21.11 14.13,21.11 U1.3 | v19.05,20.32 19.53,20.32 20.32,21.11 R8.2
  Bottom 0.254: v16.35,21.11 18.26,21.11 v19.05,20.32
GND  (via drill 0.35)
  Top 0.254: U4.7 32.54,85.09 30.48,83.03 | 30.48,83.03 27.94,83.03 C13.2 | 30.48,83.03 C14.2 | C15.C 25.4,82.55 27.62,82.55 27.94,82.87 C13.2 | UBLX_MAX-M8Q.GND@10 43.77,71.57 43.78,71.56 41.65,71.56 41.65,73.25 UBLX_MAX-M8Q.GND@12 41.43,73.18 41.43,71.92 34.57,64.31 34.49,64.31 | 22.38,71.28 22.38,72.23 21.83,72.79 | 22.38,71.28 22.38,67.47 U5.7 | 20.16,74.45 19.84,74.77 U5.26 | 20.16,74.45 21.83,72.79 | 20.16,74.45 20.48,74.77 U5.25 | 21.83,72.79 23.18,74.14 U5.21 | 22.38,71.28 25,73.9 | 25,73.9 25.08,73.98 25.08,74.77 U5.18 | 25,73.9 27.7,71.2 | 34.92,63.98 UBLX_MAX-M8Q.GND@1 34.49,64.31 | C13.2 27.78,82.55 27.78,71.28 27.7,71.2 | 19.05,25.88 17.78,25.88 | 17.78,25.88 16.51,25.88 C8.1 | 17.78,25.08 C7.1 17.78,21.11 16.99,20.32 U1.2 13.65,20.32 9.37,16.03 GND-ISO.P$1 | 17.78,25.08 17.78,25.88 | 17.78,25.08 12.7,25.08 C11.C | GND-ISO.P$1 10,15.24 5.87,19.37 C6.2 | 12.7,12.7 GND-ISO.P$3 v19.72,3.13 20.74,2.12 X2.G@3 21.91,2.22 27.79,8.11 29.76,8.11 30.32,7.55 30.32,6.19 LORATX.GND1 30.32,6.03 30.32,3.49 29.05,2.22 X2.G@4 | GND-ISO.P$1 12.7,12.7 | 12.7,12.7 GND-ISO.P$2 | LORATX.GND 34.45,21.91 34.61,22.07 34.61,24.13 C17.2 34.77,24.13 36.43,25.8 | 40.64,30.64 40.64,30 36.43,25.8 | 40.64,30.64 C10.2 | 36.43,25.8 U$2.GND | 40.64,30.64 44.93,30.64 46.04,31.75 SV1.5 46.99,40.16 48.74,41.91 | 3.49,39.05 3.49,39.69 U$4.2 | 16.19,33.66 16.19,33.97 U2.EP | 16.27,33.66 U2.6 16.26,31.05 17.84,29.46 20.32,29.46 20.32,27.15 19.05,25.88 | U2.4 15.72,35.56 15.72,34.92 16.35,34.29 U2.EP | U2.EP 17.3,35.08 17.3,35.56 U2.1 17.3,35.72 17.3,41.43 16.83,41.91 16.83,43.5 17.3,43.97 17.78,43.97 U$3.6 17.94,44.13 21.59,44.13 C5.1 21.59,43.97 25.4,43.97
  Top 0.254: U2.EP 15.72,34.77 11.11,34.77 10.16,33.81 C1.1 10.16,33.97 5.08,39.05 3.49,39.05 | 16.19,33.66 16.27,33.66 | 16.27,33.66 20.32,33.66 C2.2 | 16.19,33.66 U2.EP | 3.49,39.05 U$4.3 | U$5.GND1 31.59,44.61 30.8,44.61 30.8,45.42 | 30.8,45.42 30.8,46.04 30.96,46.2 31.58,46.2 U$5.GND2 31.75,46.2 36.67,46.2 37.47,45.4 40.32,45.4 U$5.GND 40.48,45.4 43.18,45.4 C20.1 43.18,45.24 43.97,45.24 | 25.4,43.97 26.04,43.97 26.83,43.18 26.92,43.18 | 48.74,41.91 D1.C 49.05,41.91 | 48.74,41.91 45.4,45.24 43.97,45.24 | 43.97,45.24 43.97,57.31 | 43.97,57.31 43.97,58.42 C16.1 | 43.97,57.31 37.62,57.31 36.67,56.36 35.56,56.36 U$7.P$1 35.4,56.2 35.08,55.88 27.66,55.88 25.69,57.85 33.33,65.49 33.28,65.42 | 19.05,25.88 C12.1 | 30.8,45.42 26.85,45.42 | 26.85,45.42 25.4,43.97 | LED5.3-GND 26.58,45.69 26.85,45.42 | 34.49,64.31 27.7,71.1 27.7,71.2
  Bottom 0.254: X2.G@4 27.88,3.13 v19.72,3.13 20.74,2.12 X2.G@3
  pour Top: 10.74,88.39 10.74,74.78 10.72,74.75 13,74.75 16.54,71.22 16.54,66.83 17.32,66.04 17.32,64.62 21.03,60.91 21.03,56.01 21.34,55.7 12.55,55.7 12.45,55.8 12.45,53.21 12.98,52.68 17.45,52.68 17.63,52.5 13.16,48.03 12.55,48.03 12.55,36.2 13.39,35.36 15.14,35.36 15.98,36.2 17.32,36.2 17.32,44.5 26.42,44.5 26.44,44.48 26.44,22.07 20.98,16.61 0.3,16.61 0.3,0.3 50.7,0.3 50.65,78.23 48.76,78.23 48.62,78.1 44.13,78.1 43.98,77.94 41.99,79.94 41.99,88.19
  pour Bottom: 0.53,74.55 0.53,88.49 0.56,88.52 41.91,88.54 41.91,79.25 42.93,78.23 50.52,78.18 50.52,77.8 50.42,77.9 49.94,0.53 50.14,0.33 0.25,0.33 0.2,0.28 0.2,16.51 0.41,16.71 25.86,16.71 26.87,17.73 26.87,28.02 26.26,28.63 17.45,28.63 14.45,31.62 26.54,43.71 26.54,63.73 15.72,74.55
GND-ISO
  Top 0.254: X1.5 6.03,80.55 6.03,77.95 6.92,77.06 6.92,69.85 C18.2 8.1,69.85 8.1,66.67 8.73,66.04 C19.C 8.1,66.52 1.75,60.17 1.75,58.58 2.54,57.78 R7.1 2.54,57.63 | 4.6,57.63 5.56,57.63 5.87,57.94 U$1.3 | 4.6,57.63 2.54,57.63 | 2.54,57.63 5.4,60.48 5.87,60.48 U$1.1 | U$4.6 9.37,39.05 9.37,39.69 U$4.7 9.37,39.85 10,39.85 10.16,40.01 10.16,44.93 9.37,45.72 | 9.37,51.12 11.11,51.12 11.43,50.8 C3.2 | 9.37,51.12 7.62,51.12 C4.2 7.62,51.28 4.6,54.29 4.6,57.63 | 9.37,51.12 9.37,45.72 | 9.37,45.72 R10.1
  pour Top: 0.15,37.31 9.32,37.31 11.94,39.93 11.94,48.16 15.21,51.44 15.21,57 10.72,61.49 7.59,61.49 7.59,64.29 7.92,64.62 9.45,64.62 10.08,65.25 10.08,88.77 0.15,88.77 0.13,88.75 0.13,37.34
ISET
  Top 0.254: R7.2 2.54,59.37 3.02,59.37 4.76,61.12 7.14,61.12 7.46,60.8 7.46,60.17 6.67,59.37 6.03,59.37 U$1.2
LED2
  Top 0.254: LED2.C R12.2
MISO  (via drill 0.35)  (1 unrouted)
  Top 0.254: SV1.2 45.56,27.78 47.47,27.78 48.1,27.15 48.1,23.56 44.32,19.78 33.56,19.78 31.91,21.43 31.91,21.79 LORATX.MISO v31.5,29.21 | U$2.SO 31.43,33.5 32.38,33.5 38.73,39.85 38.73,40.8 U$5.MISO
  Bottom 0.254: v31.5,29.21 33.02,30.73 v33.02,34.04
MOSI
  Top 0.254: 30.4,31.51 30.32,31.43 30.32,22.07 30.48,21.91 LORATX.MOSI 30.56,20.52 32.31,18.77 44.93,18.77 49.66,23.5 49.66,26.54 SV1.3 | 30.4,31.51 30.48,31.59 32.07,31.59 32.7,30.96 35.88,30.96 U$2.SI | U$5.MOSI 37.94,40.96 37.94,41.59 37.62,41.91 32.86,41.91 30.12,39.17 30.12,31.79 30.4,31.51
N$1
  Top 0.254: R9.1 21.27,39.37 21.27,41.91 21.59,42.23 C5.2 21.27,42.07 20.16,43.18 U$3.5
N$2
  Top 0.254: R3.1 20.32,76.99 21.75,75.56 21.75,74.93 U5.23
N$3  (via drill 0.35)
  other vias: 43.46,75.06
N$4  (via drill 0.35)
  other vias: 43.89,75.92
N$5  (via drill 0.35)
  other vias: 44.96,76
N$6  (via drill 0.35)
  other vias: 46,76
N$7
  Top 0.254: R2.1 22.86,75.72 22.54,75.41 22.54,74.93 U5.22
N$8  (via drill 0.35)
  other vias: 46.94,76
N$9  (via drill 0.35)
  other vias: 47.78,76.48
N$10  (via drill 0.35)
  other vias: 47.8,77.44
N$12
  Top 0.254: U$5.N$5 31.36,41.98 Q2.3
N$13  (via drill 0.35)
  other vias: 41.96,74.9
N$14
  Top 0.254: LED1.C R11.2
N$15  (via drill 0.35)
  other vias: 41.94,75.87
N$16  (via drill 0.35)
  other vias: 42.37,76.76
N$17
  Top 0.254: U$5.N$6 31.7,43.18 30.73,43.18 29.53,44.38 Q2.1
N$18  (via drill 0.35)
  other vias: 43.21,77.39
N$19  (via drill 0.35)
  other vias: 44.22,77.55
N$20  (via drill 0.35)
  other vias: 45.34,77.6
N$21  (via drill 0.35)
  other vias: 46.25,77.62
N$25
  Top 0.254: R2.2 LED4.A
N$26
  Top 0.202: 25.4,3.66 27.81,6.07 LORATX.ANT
  Top 0.254: X2.1 25.4,3.66
N$29
  Top 0.254: R3.2 LED3.A
N$31
  Top 0.254: R13.2 D1.A
OC
  Top 0.254: U$4.5 9.37,38.42 11.27,38.42 15.08,42.23 U$3.3
OD
  Top 0.254: U$4.4 3.33,38.42 2.86,38.42 2.54,38.73 2.54,40.64 2.86,40.96 5.4,40.96 8.57,37.78 12.06,37.78 16.19,41.91 16.19,43.5 15.72,43.97 15.24,43.97 U$3.1
RESET  (via drill 0.35)
  Top 0.254: R4.2 29.21,55.09 31.75,55.09 C9.1 31.75,54.93 35.56,51.12 | 35.56,51.12 35.56,52.86 U$7.P$2 | 35.56,51.12 35.56,49.53 U$5.RST 35.56,49.37 35.56,48.1 37.47,46.2 v37.78,46.2
  Bottom 0.254: SV1.6 44.45,39.53 v37.78,46.2
RF_IN
  Top 0.202: UBLX_MAX-M8Q.RF_IN 42.67,75.79 43.62,76.75 47.02,76.75 47.02,79.35
  Top 0.254: U$8.FEED 47.02,79.35
RXI
  Top 0.254: U$5.TXO 34.03,50.97 30.81,50.97 17.21,64.58 17.21,69.34 21.34,69.34 U5.5
SCK  (via drill 0.35)
  Top 0.254: 41.43,41.91 40.8,41.91 40.48,42.23 U$5.SCK | 41.43,41.91 R13.1 | 41.35,33.1 41.43,33.18 41.43,41.91 | 41.35,33.1 41.27,33.02 40.01,33.02 39.21,32.23 36.04,32.23 U$2.SCK | v33.66,23.34 33.18,22.86 33.18,21.91 LORATX.SCK | v41.59,33.02 41.43,33.02 41.35,33.1
  Bottom 0.254: v33.66,23.34 38.58,23.34 41.67,26.43 | SV1.4 41.67,26.43 | v41.59,33.02 41.59,26.51 41.67,26.43
SW
  Top 0.254: U1.5 11.27,19.53 7.62,19.53 L1.1
TXO
  Top 0.254: U$5.RXI 34.83,50.97 33.58,52.23 30.32,52.23 21.88,60.67 21.88,61.82 18.73,64.96 18.73,67.31 U5.1
VCC
  Top 0.254: X1.1 9.37,80.55 9.37,70.17 9.68,69.85 C18.1 9.84,69.85 9.84,67.63 11.43,66.04 C19.A 11.59,66.04 11.59,63.98 14.92,60.64 | U$1.4 6.03,56.67 7.62,55.09 C4.1 7.62,52.86 9.84,52.86 10.32,52.39 15.24,52.39 20,57.15 LED2.A 20.16,57.15 20.16,59.69 LED1.A 19.68,59.69 18.73,60.64 14.92,60.64 | 14.92,60.64 11.43,60.64 U$1.8